# Altium schematic sheet modules.SchDoc: Modules of Power Bar
size 457 x 193 mm; Author: Staok
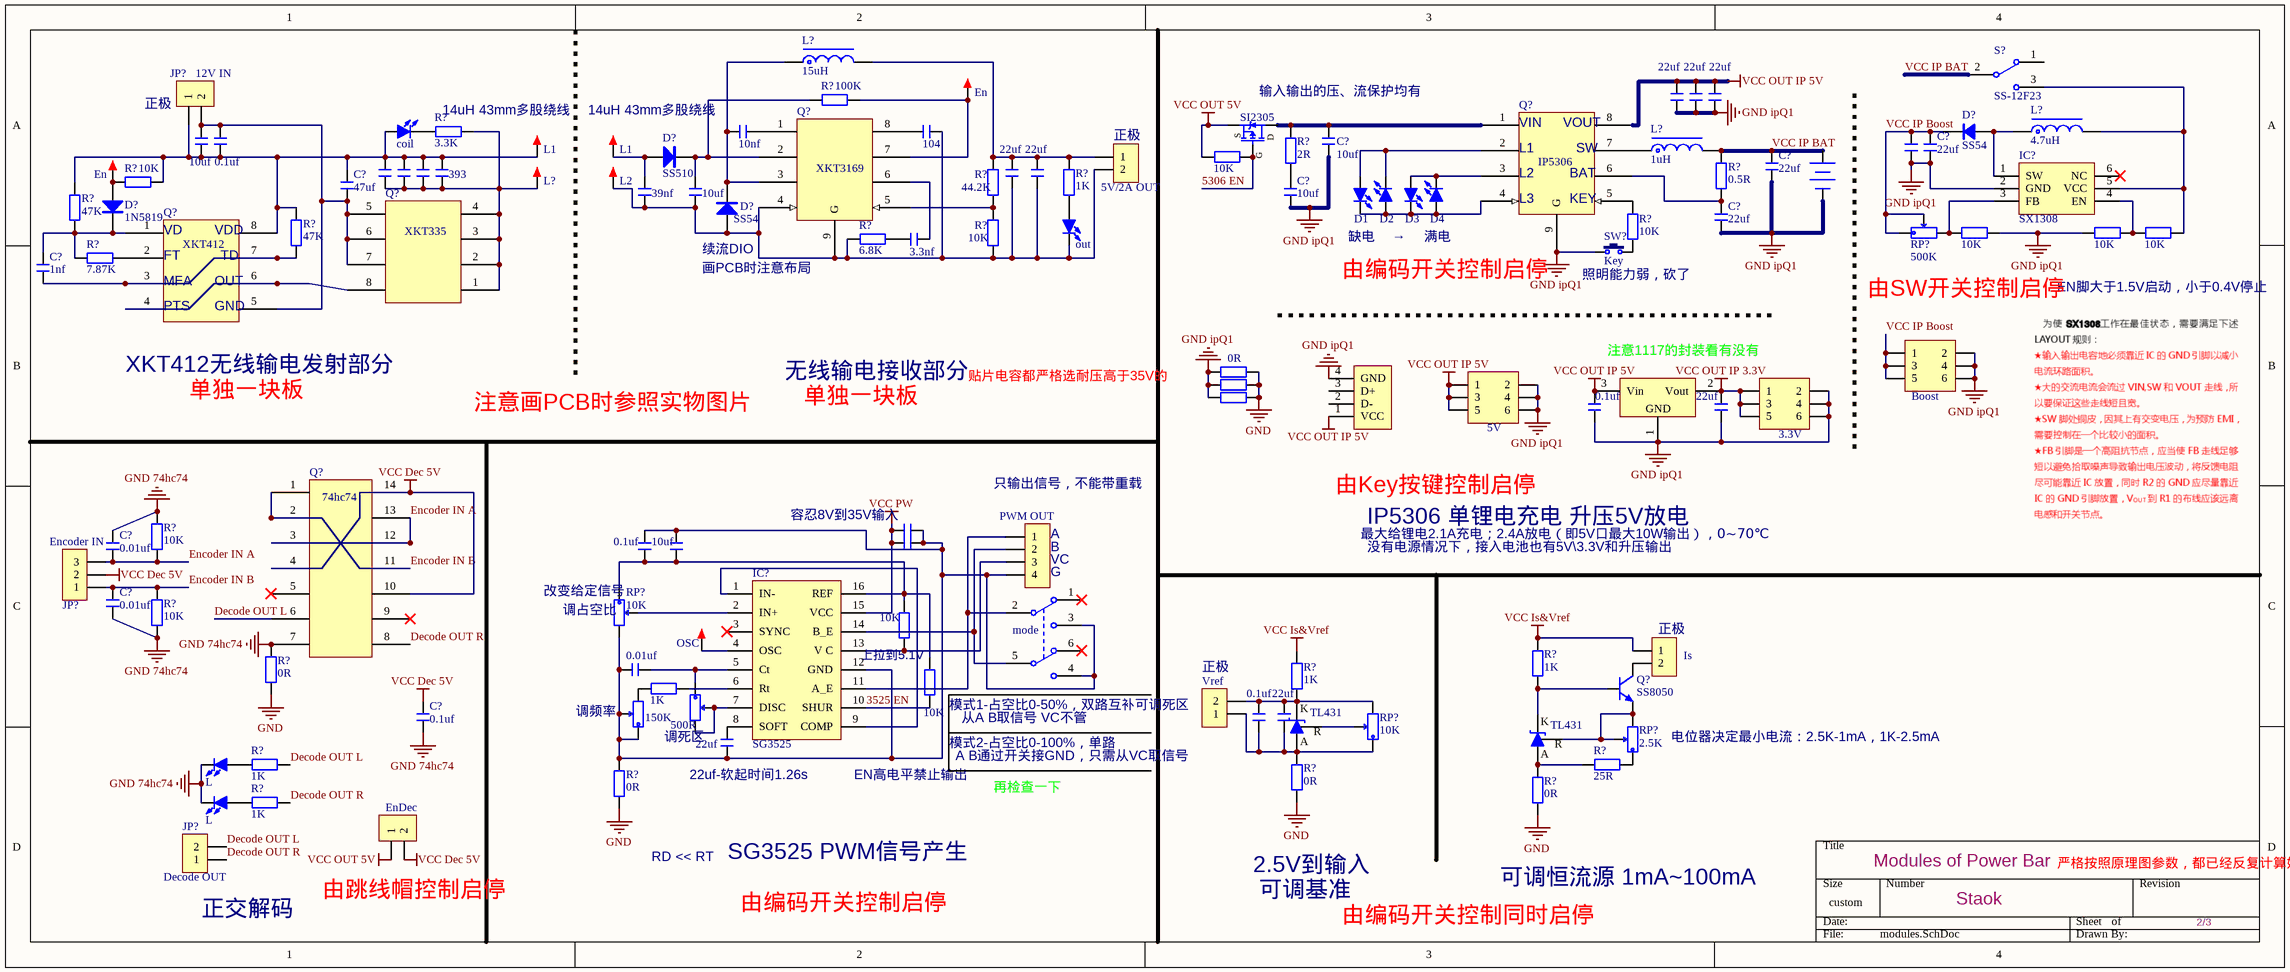
[diagram p0: modules.SchDoc]

## Parts
(Parts that share a designator on the sheet are numbered #1, #2 ... from top to bottom, then left to right.)
BT?  BATTERY  [KF128-5.08-2P]  (value not drawn)
C?#1  22uf  [C 0805_L]
C?#2  22uf  [C 0805_L]
C?#3  22uf  [C 0805_L]
C?#4  10nf  [C 0805_L]
C?#5  104  [C 0805_L]
C?#6  10uf  [C 1206_M]
C?#7  0.1uf  [C 1206_M]
C?#8  10uf  [C 0805_L]
C?#9  22uf  [C 0805_L]  (value not drawn)
C?#10  22uf  [C 0805_L]
C?#11  22uf  [C 0805_L]
C?#12  393  [C 0805_L]  (value not drawn)
C?#13  393  [C 0805_L]  (value not drawn)
C?#14  393  [C 0805_L]  (value not drawn)
C?#15  393  [C 0805_L]
C?#16  22uf  [C 0805_L]
C?#17  22uf  [C 0805_L]
C?#18  47uf  [C 1206_M]
C?#19  39nf  [C 1206_M]
C?#20  10uf  [C 0805_L]
C?#21  10uf  [C 0805_L]
C?#22  22uf  [C 0805_L]
C?#23  3.3nf  [C 0805_L]
C?#24  1nf  [C 0805_L]
C?#25  0.1uf  [C 0805_L]
C?#26  22uf  [C 0805_L]
C?#27  22uf  [C 0805_L]  (value not drawn)
C?#28  0.1uf  [C 0805_L]  (value not drawn)
C?#29  0.01uf  [C 0805_L]
C?#30  0.1uf  [C 0805_L]
C?#31  10uf  [C 0805_L]
C?#32  0.01uf  [C 0805_L]
C?#33  0.1uf  [C 0805_L]
C?#34  0.1uf  [C 0805_L]
C?#35  22uf  [C 0805_L]
C?#36  22uf  [C 0805_L]
CT?  0.01uf  [C 0805_L]
D?#1  SS54  [SMA]
D?#2  SS510  [SMC]
D?#3  1N5819  [SOD-323]
D?#4  SS54  [SMA]
IC?#1  SX1308  [SOT23-6N]
IC?#2  SG3525  [SOP16_N]
IC?#3  TL431  [SOT23-3N]
IC?#4  TL431  [SOT23-3N]
JP?#1  12V IN  [HDR2.54-LI-2P]
JP?#2  5V/2A OUT  [HDR2.54-LI-2P]
JP?#3  Boost  [HDR2.54-LI-2x3P]
JP?#4  5V  [HDR2.54-LI-2x3P]
JP?#5  3.3V  [HDR2.54-LI-2x3P]
JP?#6  PWM OUT  [HDR2.54-LI-4P]
JP?#7  Encoder IN  [HDR2.54-M-LI-3P]
JP?#8  Is  [HDR2.54-LI-2P]
JP?#9  Vref  [HDR2.54-LI-2P]
JP?#10  Decode OUT  [HDR2.54-LI-2P]
JP?#11  EnDec  [HDR2.54-LI-2P]
L?#1  15uH  [L-SMD-0630]
L?#2  4.7uH  [L-SMD-0630]
L?#3  1uH  [L-SMD-0630]
LED?#1  coil  [LED 0805B]
LED?#2  D1  [LED 0805B]
LED?#3  D3  [LED 0805B]
LED?#4  out  [LED 0805B]
LED?#5  D2  [LED 0805B]
LED?#6  D4  [LED 0805B]
LED?#7  L  [LED 0805B]
LED?#8  L  [LED 0805B]
Q?#1  SI2305  [SOT23-3N]
Q?#2  IP5306  [ESOP8_M]
Q?#3  XKT3169  [ESOP8_M]
Q?#4  XKT412  [SOP8_M]
Q?#5  XKT335  [SOP8_M]
Q?#6  74hc74  [SOP14_N]
Q?#7  SS8050  [SOT23-3N]
R?#1  100K  [R 0805_L]
R?#2  2R  [R 0805_L]
R?#3  3.3K  [R 0805_L]
R?#4  0.5R  [R 0805_L]
R?#5  44.2K  [R 0805_L]
R?#6  10K  [R 0805_L]
R?#7  47K  [R 0805_L]
R?#8  10K  [R 0805_L]
R?#9  10K  [R 0805_L]
R?#10  1K  [R 0805_L]
R?#11  10K  [R 0805_L]
R?#12  10K  [R 0805_L]
R?#13  10K  [R 0805_L]
R?#14  6.8K  [R 0805_L]
R?#15  10K  [R 0805_L]
R?#16  7.87K  [R 0805_L]
R?#17  47K  [R 0805_L]
R?#18  0R  [R 0805_L]
R?#19  0R  [R 0805_L]  (value not drawn)
R?#20  0R  [R 0805_L]  (value not drawn)
R?#21  10K  [R 0805_L]
R?#22  10K  [R 0805_L]
R?#23  10K  [R 0805_L]
R?#24  1K  [R 0805_L]
R?#25  1K  [R 0805_L]
R?#26  1K  [R 0805_L]
R?#27  0R  [R 0805_L]
R?#28  10K  [R 0805_L]
R?#29  0R  [R 0805_L]
R?#30  0R  [R 0805_L]
R?#31  1K  [R 0805_L]
R?#32  0R  [R 0805_L]
R?#33  25R  [R 0805_L]
R?#34  1K  [R 0805_L]
RD?  500R  [3362P]
RP?#1  500K  [3296W]
RP?#2  10K  [3362P]
RP?#3  10K  [3296W]
RP?#4  2.5K  [3296W]
RT?  150K  [3362P]
S?#1  SS-12F23  [SS-12D10]
S?#2  mode  [SS-22H07-G5]
SW?  Key  [TSW SMD-3*6*2.5]
TP?#1  En  [TEST 1]
TP?#2  L1  [TEST 2.0]
TP?#3  L1  [TEST 2.0]
TP?#4  En  [TEST 1]
TP?#5  L?  [TEST 2.0]
TP?#6  L2  [TEST 2.0]
TP?#7  OSC  [TEST 1]
USB?  USB  [USB-A/S_A]  (value not drawn)
V?  AMS1117-3V3  [SOT89_M]  (value not drawn)

## Nets
GND: R?#18.2 R?#19.2 R?#20.2 R?#27.1 R?#29.2 R?#30.2 R?#32.2
GND 74hc74: C?#29.2 C?#32.1 C?#33.1 LED?#7.2(K) LED?#8.2(K) Q?#6.7 R?#21.2 R?#23.1 R?#27.2
GND ipQ1: BT?.2(-) C?#1.1 C?#2.1 C?#3.1 C?#8.1 C?#9.1 C?#10.1 C?#11.1 C?#21.1 C?#22.1 C?#25.1 C?#26.1 IC?#1.2(GND) JP?#3.2 JP?#3.4 JP?#3.6 JP?#4.2 JP?#4.4 JP?#4.6 JP?#5.2 JP?#5.4 JP?#5.6 Q?#2.9(G) R?#11.1 R?#12.1 R?#18.1 R?#19.1 R?#20.1 SW?.1 USB?.4(GND) V?.1(GND)
VCC Dec 5V: C?#33.2 JP?#7.2 JP?#11.2 Q?#6.4 Q?#6.10 Q?#6.14
VCC Is&Vref: JP?#8.1 R?#24.1 R?#25.1
VCC OUT 5V: JP?#11.1 Q?#1.2(S) R?#6.2
VCC OUT IP 3.3V: C?#26.2 JP?#5.1 JP?#5.3 JP?#5.5 V?.2(Vout)
VCC OUT IP 5V: C?#1.2 C?#2.2 C?#3.2 C?#25.2 JP?#4.1 JP?#4.3 JP?#4.5 Q?#2.8 USB?.1(VCC) V?.3(Vin)
VCC PW: C?#27.2 C?#28.2 IC?#2.15(VCC)
3525 EN: IC?#2.10(SHUR) R?#28.1
5306 EN: Q?#1.1(G) R?#6.1
Decode OUT L: JP?#10.2 Q?#6.6 R?#31.1
Decode OUT R: JP?#10.1 Q?#6.8 R?#34.1
Encoder IN A: C?#29.1 JP?#7.3 Q?#6.3 Q?#6.12 Q?#6.13 R?#21.1
Encoder IN B: C?#32.2 JP?#7.1 Q?#6.1 Q?#6.2 Q?#6.11 R?#23.2
VCC IP BAT: BT?.1(+) C?#11.2 L?#3.2 R?#4.1 S?#1.2
VCC IP Boost: C?#9.2 C?#10.2 D?#1.2(K) JP?#3.1 JP?#3.3 JP?#3.5 RP?#1.1 RP?#1.2
NetC?#4_1: C?#4.1 D?#4.2(K) L?#1.1 Q?#3.3
NetC?#4_2: C?#4.2 Q?#3.1
NetC?#5_1: C?#5.1 Q?#3.8
NetC?#5_2: C?#5.2 C?#16.1 C?#17.1 C?#19.1 C?#20.1 D?#4.1(A) JP?#2.2 LED?#4.2(K) Q?#3.4 Q?#3.9(G) R?#9.2 R?#14.1 TP?#6.1
NetC?#6_1: C?#6.1 C?#7.1 C?#12.2 C?#13.2 C?#14.2 C?#15.2 C?#18.2 JP?#1.1 LED?#1.1(A) Q?#4.8 R?#7.1 R?#8.1 R?#17.2 TP?#2.1
NetC?#6_2: C?#6.2 C?#7.2 C?#18.1 JP?#1.2 Q?#4.5 Q?#5.5 Q?#5.6 Q?#5.7
NetC?#8_2: C?#8.2 Q?#1.3(D) Q?#2.1 R?#2.1
NetC?#12_1: C?#12.1 C?#13.1 C?#14.1 C?#15.1 Q?#5.1 Q?#5.2 Q?#5.3 Q?#5.4 R?#3.1 TP?#5.1
NetC?#16_2: C?#16.2 C?#17.2 JP?#2.1 L?#1.2 R?#5.1 R?#10.2
NetC?#19_2: C?#19.2 D?#2.1(A) TP?#3.1
NetC?#20_2: C?#20.2 D?#2.2(K) Q?#3.2 R?#1.2
NetC?#21_2: C?#21.2 R?#2.2
NetC?#22_2: C?#22.2 Q?#2.6 R?#4.2
NetC?#23_1: C?#23.1 Q?#3.6
NetC?#23_2: C?#23.2 R?#14.2
NetC?#24_1: C?#24.1 Q?#4.3 Q?#4.7 R?#17.1
NetC?#24_2: C?#24.2 D?#3.2(K) Q?#4.1 R?#7.2 R?#16.1
NetC?#27_1: C?#27.1 C?#28.1 C?#30.2 C?#31.2 C?#36.1 CT?.2 IC?#2.12(GND) JP?#6.4 R?#30.1 RP?#2.3 RT?.1 RT?.2 S?#2.3 S?#2.4
NetC?#30_1: C?#30.1 C?#31.1 IC?#2.16(REF) R?#22.1 R?#28.2 RP?#2.1
NetC?#34_1: C?#34.1 C?#35.1 IC?#3.3(A) JP?#9.1 R?#29.1 RP?#3.1
NetC?#34_2: C?#34.2 C?#35.2 IC?#3.1(K) JP?#9.2 R?#25.2 RP?#3.3
NetC?#36_2: C?#36.2 IC?#2.8(SOFT)
NetCT?_1: CT?.1 IC?#2.5(Ct) RD?.1
NetD?#1_1: D?#1.1(A) IC?#1.1(SW) L?#2.1
NetD?#3_1: D?#3.1(A) R?#8.2 TP?#4.1
NetIC?#1_3: IC?#1.3(FB) R?#11.2 RP?#1.3
NetIC?#1_4: IC?#1.4(EN) R?#12.2 R?#13.1
NetIC?#1_5: IC?#1.5(VCC) L?#2.2 R?#13.2 S?#1.3
NetIC?#2_1: IC?#2.1(IN-) IC?#2.9(COMP)
NetIC?#2_2: IC?#2.2(IN+) RP?#2.2
NetIC?#2_4: IC?#2.4(OSC) TP?#7.1
NetIC?#2_6: IC?#2.6(Rt) R?#26.1
NetIC?#2_7: IC?#2.7(DISC) RD?.2 RD?.3
NetIC?#2_11: IC?#2.11(A_E) JP?#6.1 S?#2.2
NetIC?#2_13: IC?#2.13(V_C) JP?#6.3 R?#22.2
NetIC?#2_14: IC?#2.14(B_E) JP?#6.2 S?#2.5
NetIC?#3_2: IC?#3.2(R) RP?#3.2
NetIC?#4_1: IC?#4.1(K) Q?#7.1(B) R?#24.2
NetIC?#4_2: IC?#4.2(R) Q?#7.2(E) RP?#4.2 RP?#4.3
NetIC?#4_3: IC?#4.3(A) R?#32.1 R?#33.1
NetJP?#8_2: JP?#8.2 Q?#7.3(C)
NetL?#3_1: L?#3.1 Q?#2.7
NetLED?#1_2: LED?#1.2(K) R?#3.2
NetLED?#2_1: LED?#2.1(A) LED?#5.2(K) Q?#2.2
NetLED?#2_2: LED?#2.2(K) LED?#3.2(K) LED?#5.1(A) LED?#6.1(A) Q?#2.4
NetLED?#3_1: LED?#3.1(A) LED?#6.2(K) Q?#2.3
NetLED?#4_1: LED?#4.1(A) R?#10.1
NetLED?#7_1: LED?#7.1(A) R?#31.2
NetLED?#8_1: LED?#8.1(A) R?#34.2
NetQ?#2_5: Q?#2.5 R?#15.2
NetQ?#3_5: Q?#3.5 R?#5.2 R?#9.1
NetQ?#3_7: Q?#3.7 R?#1.1 TP?#1.1
NetQ?#4_2: Q?#4.2 R?#16.2
NetQ?#4_4: Q?#4.4 Q?#4.6 Q?#5.8
NetR?#15_1: R?#15.1 SW?.2
NetR?#26_2: R?#26.2 RT?.3
NetR?#33_2: R?#33.2 RP?#4.1

Not connected (* = marked no-connect by the designer): IC?#1 6(NC)*; IC?#2 3(SYNC)*; Q?#6 5* 9*; S?#1 1; S?#2 1* 6*; USB? 2(D-) 3(D+)

## Notes on the sheet
- (near JP?#1) 正极
- 输入输出的压、流保护均有
- (near R?#3) 14uH 43mm多股绕线
- 14uH 43mm多股绕线
- (near JP?#2) 正极
- (near Q?#2) VIN
- (near Q?#2) L1
- (near Q?#2) VOUT
- (near Q?#2) SW
- (near Q?#4) VD
- (near Q?#4) VDD
- (near Q?#2) L2
- (near Q?#2) L3
- (near Q?#2) BAT
- (near Q?#2) KEY
- (near Q?#4) FT
- (near Q?#4) MFA
- (near Q?#4) OUT
- (near Q?#4) TD
- (near D?#4) 续流DIO
- 画PCB时注意布局
- 由编码开关控制启停
- (near LED?#2) 缺电
- (near LED?#5) →
- (near LED?#6) 满电
- (near SW?) 照明能力弱，砍了
- (near R?#12) EN脚大于1.5V启动，小于0.4V停止
- (near Q?#4) PTS
- (near Q?#4) GND
- 注意1117的封装看有没有
- 由SW开关控制启停
- (near Q?#4) XKT412无线输电发射部分
- 单独一块板
- 注意画PCB时参照实物图片
- 无线输电接收部分
- 贴片电容都严格选耐压高于35V的
- (near JP?#6) 只输出信号，不能带重载
- (near C?#27) 容忍8V到35V输入
- (near JP?#6) A
- 由Key按键控制启停
- 最大给锂电2.1A充电；2.4A放电（即5V口最大10W输出），0~70℃
- IP5306 单锂电充电 升压5V放电
- (near RP?#2) 改变给定信号
- (near RP?#2) 调占空比
- (near JP?#6) B
- G
- VC
- 没有电源情况下，接入电池也有5V\3.3V和升压输出
- 上拉到5.1V
- (near JP?#9) 正极
- (near JP?#8) 正极
- 调频率
- 调死区
- 模式1-占空比0-50%，双路互补可调死区
- 从A B取信号 VC不管
- 电位器决定最小电流：2.5K-1mA，1K-2.5mA
- (near C?#36) 22uf-软起时间1.26s
- (near IC?#2) EN高电平禁止输出
- 模式2-占空比0-100%，单路
- A B通过开关接GND，只需从VC取信号
- 再检查一下
- RD << RT
- SG3525 PWM信号产生
- 严格按照原理图参数，都已经反复计算好
- (near JP?#10) 正交解码
- (near JP?#11) 由跳线帽控制启停
- 2.5V到输入
- 可调基准
- 由编码开关控制同时启停
- 可调恒流源 1mA~100mA
- 2/3

## Library data of the parts
BT? = BATTERY: Multicell Battery; Published: 24-Mar-1999; LatestRevisionDate: 17-Jul-2002; LatestRevisionNote: Re-released for DXP Platform.; PackageReference: BAT-2; Publisher: Altium Limited
C?#1-C?#36 CT? = C: 无极性贴片电容; 版权归属: 源创客; 材质: X7R; BOM名称: 无极性贴片电容; 学习资源: www.ooocke.com
D?#1 = SS54: 肖特基二极管; 版权归属: 源创客; 属性: 40V/3A; BOM名称: 肖特基二极管; 学习资源: www.ooocke.com
D?#2-D?#4 = 1N4148: 高速开关二极管; 版权归属: 源创客; BOM名称: 高速开关二极管; 学习资源: www.ooocke.com
IC?#1 = SX1308: 可调升压芯片; 版权归属: 源创客; BOM名称: 可调升压芯片; 学习资源: www.ooocke.com
IC?#2 = GS3525: 开关电源管理IC; BOM名称: 电源管理IC; 版权归属: 源创客; 学习资源: www.ooocke.com
IC?#3 IC?#4 = TL431_SMD: 可调基准稳压芯片; 版权归属: 源创客; BOM名称: 可调基准稳压芯片; 学习资源: www.ooocke.com
JP?#1 JP?#2 JP?#8-JP?#11 = Header 2: 2P接插件; 版权归属: 源创客; BOM名称: 2P接插件; 学习资源: www.ooocke.com
JP?#3-JP?#5 = Header 3X2: 3*2P接插件; 版权归属: 源创客; BOM名称: 3*2P接插件; 学习资源: www.ooocke.com
JP?#6 = Header 4: 4P接插件; 版权归属: 源创客; BOM名称: 4P接插件; 学习资源: www.ooocke.com
JP?#7 = Header 3: 3P接插件; 版权归属: 源创客; BOM名称: 3P接插件; 学习资源: www.ooocke.com
L?#1-L?#3 = L-CDRH: 功率屏蔽电感; 版权归属: 源创客; BOM名称: 功率屏蔽电感; 学习资源: www.ooocke.com
LED?#1-LED?#8 = LED-SMD: 贴片LED; 版权归属: 源创客; BOM名称: 贴片LED; 学习资源: www.ooocke.com
Q?#1 = SI2301: P沟道 20V/2.8A; BOM名称: 场效应管; 版权归属: 源创客; 学习资源: www.ooocke.com; 描述: P沟道 20V/2.8A
Q?#2 Q?#3 = ESOP8
Q?#4 Q?#5 = 8
Q?#6 = 14
Q?#7 = 8050-SMD: 高频放大-NPN型; 版权归属: 源创客; 属性: 40V 1.5A 1W 100MHZ; BOM名称: 高频放大-NPN型; 学习资源: www.ooocke.com
R?#1-R?#34 = R: 贴片电阻; 版权归属: 源创客; BOM名称: 贴片电阻; 学习资源: www.ooocke.com
RD? RP?#1-RP?#4 RT? = RP-ID: 插件单联电位器; BOM名称: 插件电位器; 版权归属: 源创客; 学习资源: www.ooocke.com
S?#1 = SSW-1P: 1路波动开关; BOM名称: 波动开关; 版权归属: 源创客; 学习资源: www.ooocke.com
S?#2 = SSW-2P: 2路波动开关; BOM名称: 波动开关; 版权归属: 源创客; 学习资源: www.ooocke.com
SW? = TSW 3x6: 3x6轻触开关; 版权归属: 源创客; BOM名称: 3x6轻触开关; 学习资源: www.ooocke.com
TP?#1-TP?#7 = TEST: 测试点; 版权归属: 源创客; BOM名称: 测试点; 学习资源: www.ooocke.com
USB? = USB-A/S: USB-A型母接口; 版权归属: 源创客; BOM名称: USB-A型母接口; 学习资源: www.ooocke.com
V? = AMS1117: 三端稳压芯片; BOM名称: 稳压芯片; 版权归属: 源创客; 学习资源: www.ooocke.com